# Altium schematic sheet test.SchDoc
size A; SheetNumber: 2; SheetTotal: 2
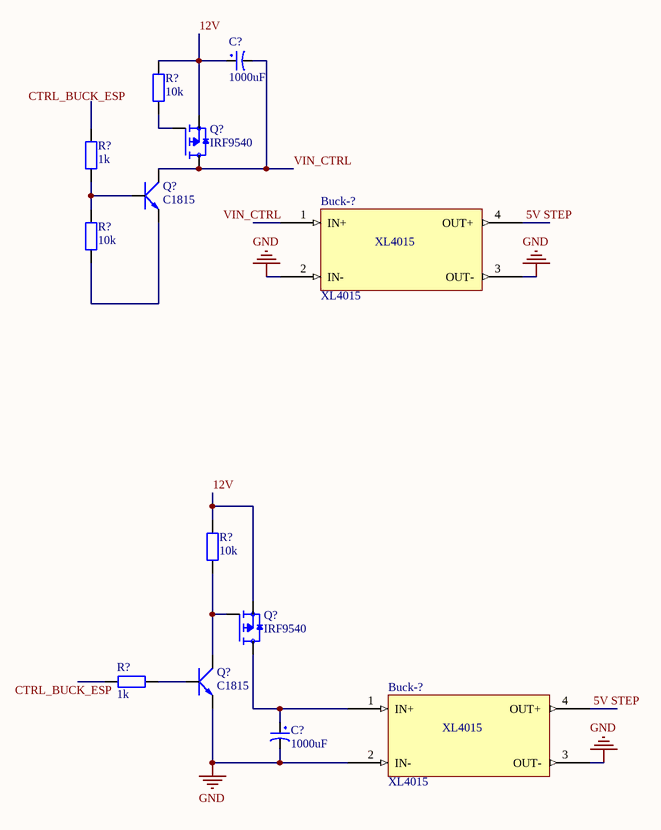
[diagram p0: test.SchDoc]

## Parts
(Parts that share a designator on the sheet are numbered #1, #2 ... from top to bottom, then left to right.)
Buck-?#1  XL4015  [DIP4]
Buck-?#2  XL4015  [DIP4]
C?#1  1000uF  [tu hoa 8mm]
C?#2  1000uF  [tu hoa 8mm]
Q?#1  IRF9540  [TO254P1052X465X1989-3]
Q?#2  C1815  [TO92]
Q?#3  IRF9540  [TO254P1052X465X1989-3]
Q?#4  C1815  [TO92]
R?#1  10k  [tro vach 1/4w]
R?#2  1k  [tro vach 1/4w]
R?#3  10k  [tro vach 1/4w]
R?#4  10k  [tro vach 1/4w]
R?#5  1k  [tro vach 1/4w]

## Nets
GND: Buck-?#1.2(IN-) Buck-?#1.3(OUT-) Buck-?#2.2(IN-) Buck-?#2.3(OUT-) C?#2.2 Q?#4.1(E)
5V STEP: Buck-?#1.4(OUT+) Buck-?#2.4(OUT+)
12V: C?#1.1 Q?#1.3(S) Q?#3.3(S) R?#1.2 R?#4.2
VIN_CTRL: Buck-?#1.1(IN+) C?#1.2 Q?#1.2(D) Q?#2.2(C)
NetBuck-?#2_1: Buck-?#2.1(IN+) C?#2.1 Q?#3.2(D)
NetQ?#1_1: Q?#1.1(G) R?#1.1
NetQ?#2_1: Q?#2.1(E) R?#3.1
NetQ?#2_3: Q?#2.3(B) R?#2.2 R?#3.2
NetQ?#3_1: Q?#3.1(G) Q?#4.2(C) R?#4.1
NetQ?#4_3: Q?#4.3(B) R?#5.2

Not connected (* = marked no-connect by the designer): R?#2 1; R?#5 1

## Notes on the sheet
- Labels drawn without touching a wire or pin: CTRL_BUCK_ESP

## Library data of the parts
C?#1 C?#2 = Tu Hoa 1000uF 16V 8x20: Cắm; Don_Vi: Con; So_Chan: 2; Ten_Linh_Kien: Tụ Hóa 1000uF 16V 8x20MM; Ma_Hang: MH008300; Chung_Loai: Cắm; Kieu_Chan: *
Q?#1 Q?#3 = IRF9540: P-Channel 100 V 19A (Tc) 3.7W (Ta), 150W (Tc) Surface Mount DÂ²PAK (TO-263); MF: Vishay; SnapEDA_Link: https://www.snapeda.com/parts/IRF9540/Vishay+Siliconix/view-part/?ref=snap; Package: TO-220-3 Vishay; Value: *; MP: IRF9540; Check_prices: https://www.snapeda.com/parts/IRF9540/Vishay+Siliconix/view-part/?ref=eda
Q?#2 Q?#4 = Trans C1815 DIP: NPN transistor; Value: C9014
R?#1 R?#3 R?#4 = Tro Vach 1/4W 5% 10k: Căm; Chung_Loai: Cắm; Don_Vi: Con; So_Chan: 2; Ten_Linh_Kien: Trở Vạch 1/4w 5% 10K; Ma_Hang: MH007354; Kieu_Chan: *
R?#2 R?#5 = Tro Vach 1/4W 5% 1k: Cắm; Don_Vi: Con; So_Chan: 2; Ten_Linh_Kien: Trở Vạch 1/4w 5% 1k; Ma_Hang: MH007390; Chung_Loai: Cắm; Kieu_Chan: *